# Altium schematic sheet Dual_Channel_Common_VCC.SchDoc
size A
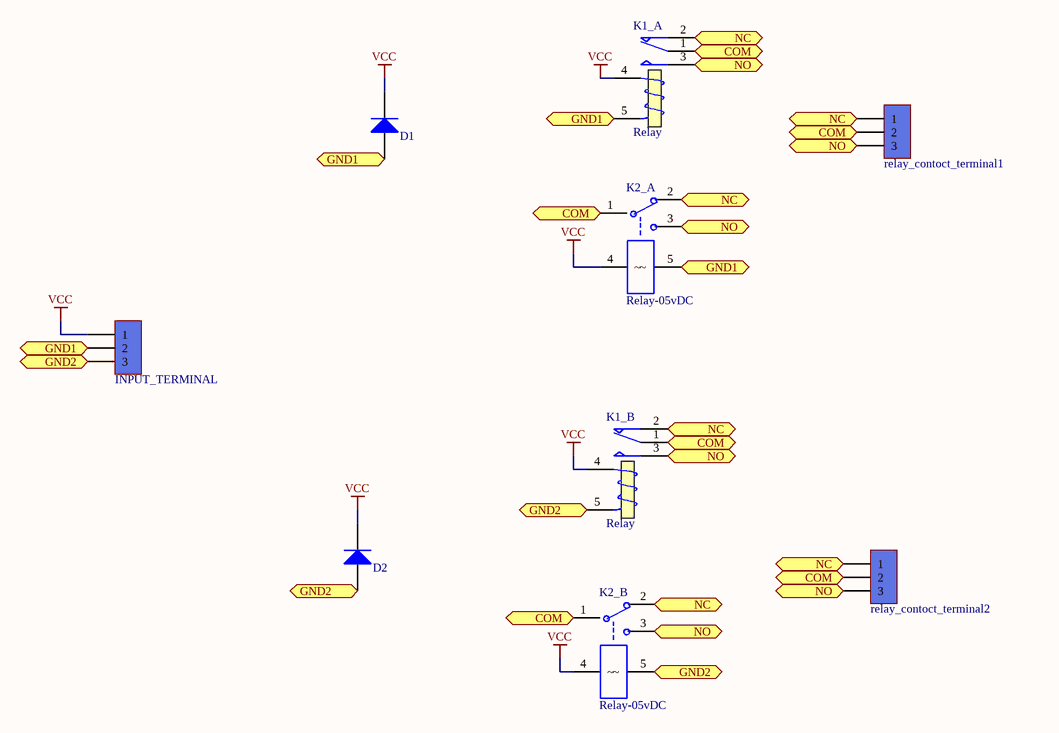
[diagram p0: Dual_Channel_Common_VCC.SchDoc]

## Parts
D1  Diode 1N4007 vertical  [D 50mm]  (value not drawn)
D2  Diode 1N4007 vertical  [D 50mm]  (value not drawn)
INPUT_TERMINAL  Terminal  [Terminal 1*3]  (value not drawn)
K1_A  Relay  [Relay 15.40x12.10x13.10]
K1_B  Relay  [Relay 15.40x12.10x13.10]
K2_A  Relay-05vDC  [Relays]
K2_B  Relay-05vDC  [Relays]
relay_contoct_terminal1  Terminal  [Terminal 1*3]  (value not drawn)
relay_contoct_terminal2  Terminal  [Terminal 1*3]  (value not drawn)

## Ports
COM, GND1, GND2, NC, NO

## Nets
VCC: D1.2(K) D2.2(K) INPUT_TERMINAL.1 K1_A.4(T1) K1_B.4(T1) K2_A.4 K2_B.4
COM: K1_A.1(COM) K1_B.1(COM) K2_A.1(COM) K2_B.1(COM) relay_contoct_terminal1.2 relay_contoct_terminal2.2 ; port COM
GND1: D1.1(A) INPUT_TERMINAL.2 K1_A.5(T2) K2_A.5 ; port GND1
GND2: D2.1(A) INPUT_TERMINAL.3 K1_B.5(T2) K2_B.5 ; port GND2
NC: K1_A.2(NC) K1_B.2(NC) K2_A.2(NC) K2_B.2(NC) relay_contoct_terminal1.1 relay_contoct_terminal2.1 ; port NC
NO: K1_A.3(NO) K1_B.3(NO) K2_A.3(NO) K2_B.3(NO) relay_contoct_terminal1.3 relay_contoct_terminal2.3 ; port NO

## Library data of the parts
D1 D2 = Diode 1N4007 vertical: 1 Amp General Purpose Rectifier; Publisher: seyed mohsen ghasemian
INPUT_TERMINAL relay_contoct_terminal1 relay_contoct_terminal2 = Terminal 1*3: Terminal 3 Pin 250VAC 16A; Designer: Seyed Mohsen Ghasemain; E-mail: picpars@gmail.com; ComponentLinkURL: www.picpars.com
K1_A K1_B = Relay: SPDT Relay; Designer: Eng. Saeid Jorablo; Company: E.P.I.L; Design_Date: 2011/10/31
K2_A K2_B = Relay-05vDC: Relay-05vDC-240AC 5A; Designer: Seyed Mohsen Ghasemain; ComponentLinkURL: www.picpars.com